# EAGLE design LoRaLo_V30a (EAGLE 7.5.0)
RFM95W
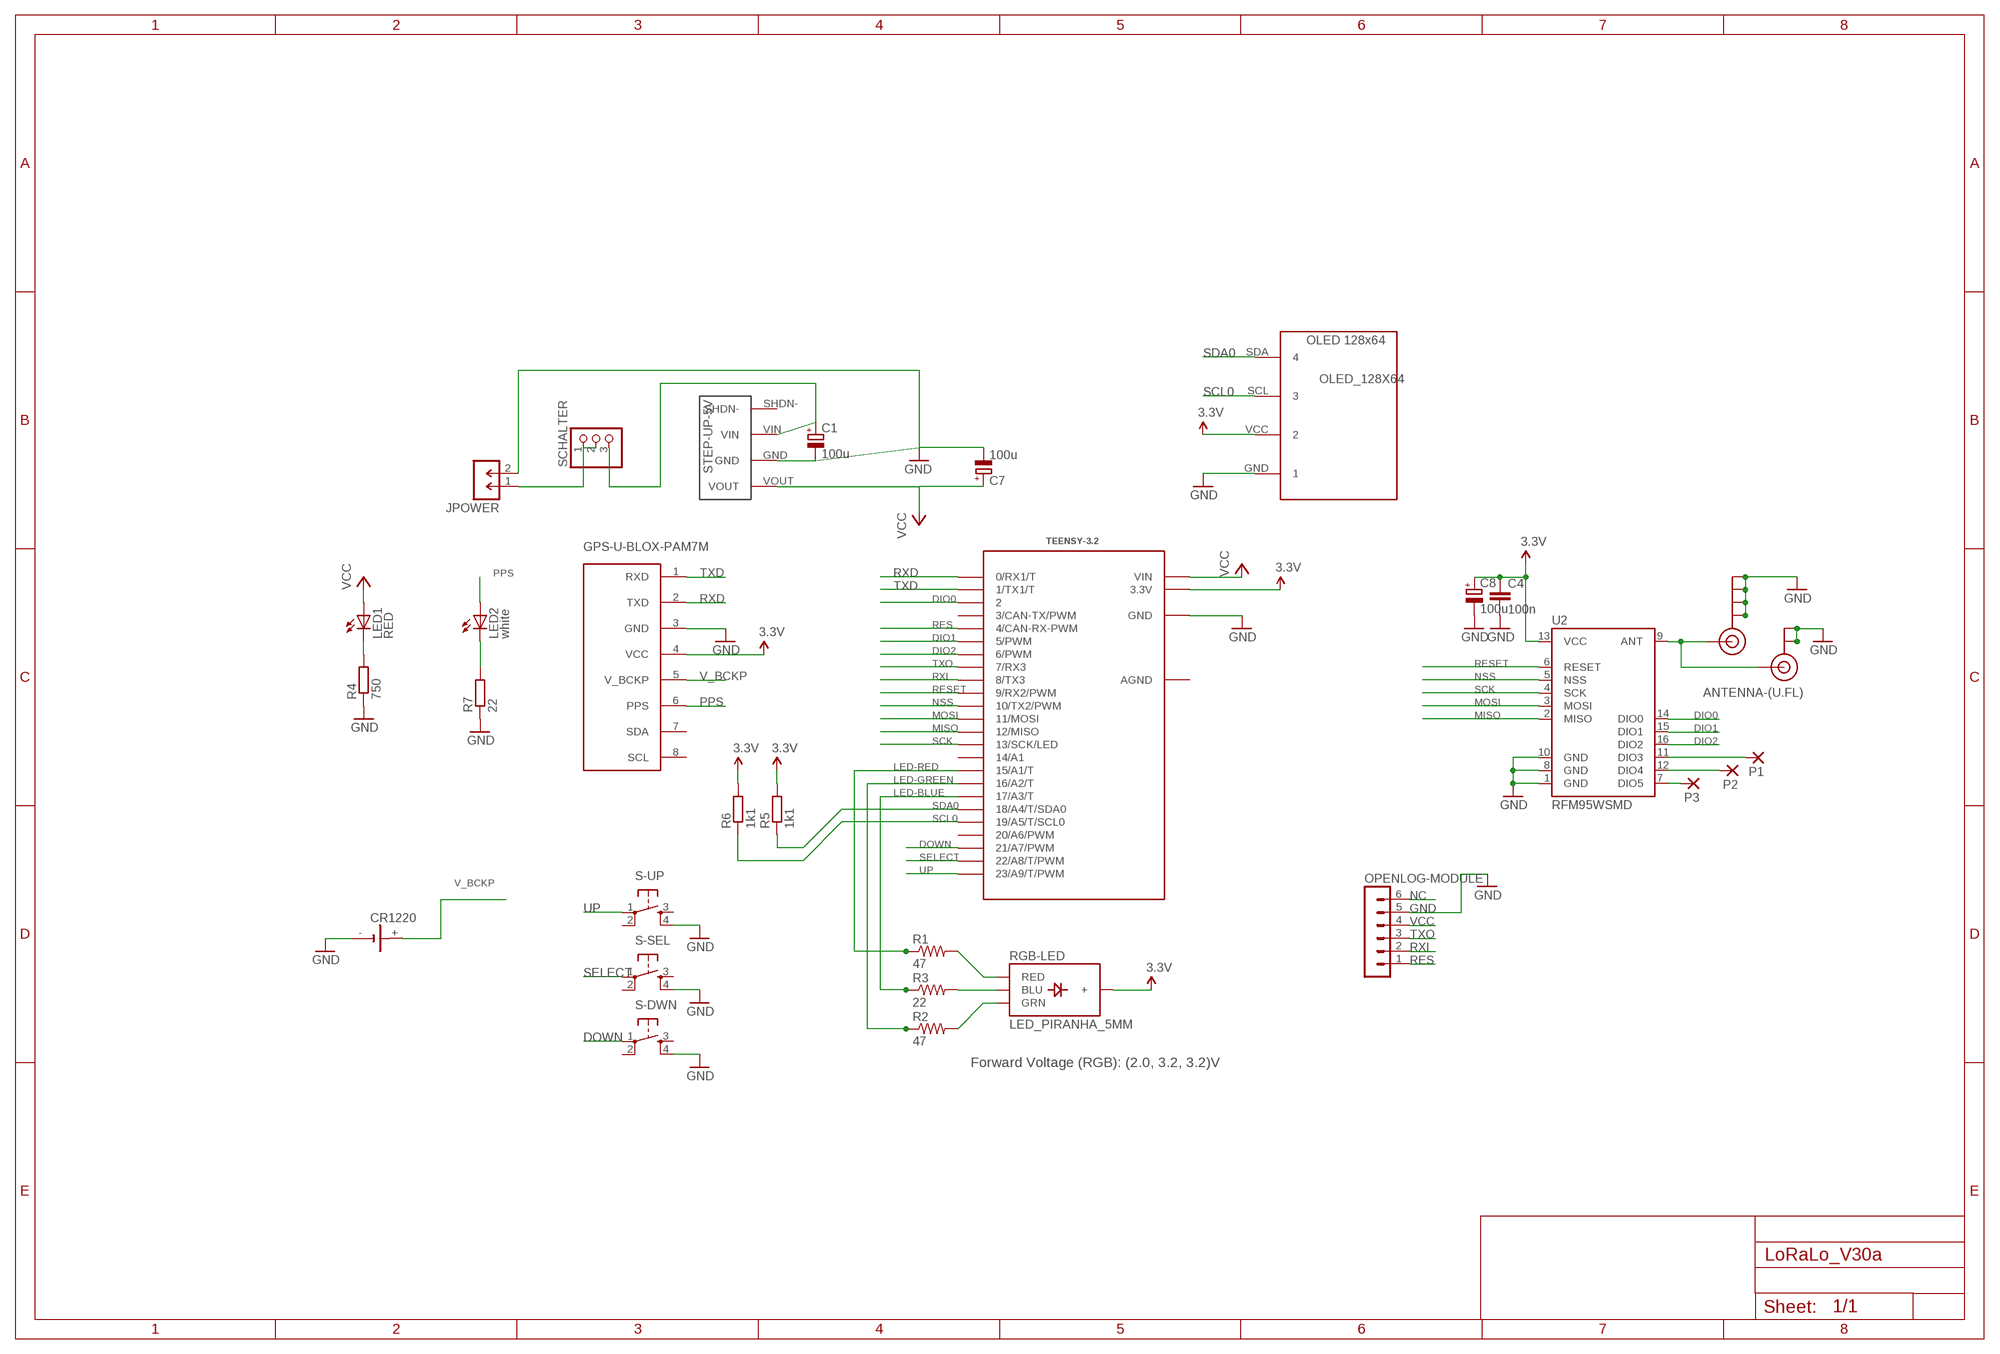
[diagram p0: schematic, sheet 1]

## Parts
ANTENNA-(EDGE-MOUNT)  SMA_EDGE  [SMA-EDGE]
ANTENNA-(U.FL)  U.FL  [U.FL]
C1  100u  CPOL-EUD  [PANASONIC_D]
C4  100n  C-EUC1206  [C1206]
C7  100u  CPOL-EUD  [PANASONIC_D]
C8  100u  CPOL-EUD  [PANASONIC_D]
CR1220  CH291-1220LF  [CH291-1220LF]
GPS-U-BLOX-PAM7M  U-BLOX-PAM-7Q  [U-BLOX-PAM-7Q]
JPOWER  M-1X02-SIP-100-40  [SIP-100-02-40]
LED1  RED  LED1206  [LED-1206]
LED2  white  LED1206  [LED-1206]
OLED_128X64  OLED_128X64  [OLED_128X64]
OPENLOG-MODULE  MA06-1  [MA06-1]
P1  1,6/0,8  [1,6/0,8]
P2  1,6/0,8  [1,6/0,8]
P3  1,6/0,8  [1,6/0,8]
R1  47  RESISTOR1206  [1206]
R2  47  RESISTOR1206  [1206]
R3  22  RESISTOR1206  [1206]
R4  750  R-EU_M1206  [M1206]
R5  1k1  R-EU_M1206  [M1206]
R6  1k1  R-EU_M1206  [M1206]
R7  22  R-EU_M1206  [M1206]
RGB-LED  LED_PIRANHA_5MM  [LED_PIRANHA_5MM]
S-DWN  TAC_SWITCHPTH  [TACTILE-PTH]
S-SEL  TAC_SWITCHPTH  [TACTILE-PTH]
S-UP  TAC_SWITCHPTH  [TACTILE-PTH]
SCHALTER  PINHD-1X3  [1X03]
STEP-UP-5V  POLOLU_STEP-UP  [POLOLU_STEP-UP]
TEENSY-3.2  TEENSY_3.1_DIL  [TEENSY3-DIL]
U2  RFM95WSMD  [RFM95W_SMD]

## Nets
3.3V [power]: C4.1 C8.+ GPS-U-BLOX-PAM7M.4(VCC) OLED_128X64.VCC R5.2 R6.2 RGB-LED.+ TEENSY-3.2.3.3V U2.13(VCC)
DIO0: TEENSY-3.2.2 U2.14(DIO0)
DIO1: TEENSY-3.2.5(5/PWM) U2.15(DIO1)
DIO2: TEENSY-3.2.6(6/PWM) U2.16(DIO2)
DOWN: S-DWN.1 TEENSY-3.2.21/A7(21/A7/PWM)
GND [power]: ANTENNA-(EDGE-MOUNT).GND@0(GND) ANTENNA-(EDGE-MOUNT).GND@1(GND) ANTENNA-(EDGE-MOUNT).GND@2(GND) ANTENNA-(EDGE-MOUNT).GND@3(GND) ANTENNA-(U.FL).P$1(GND) ANTENNA-(U.FL).P$2(GND) C1.- C4.2 C7.- C8.- CR1220.- GPS-U-BLOX-PAM7M.3(GND) JPOWER.2 OLED_128X64.GND OPENLOG-MODULE.5 R4.1 R7.1 S-DWN.4 S-SEL.4 S-UP.4 STEP-UP-5V.GND TEENSY-3.2.GND U2.1(GND) U2.8(GND) U2.10(GND)
LED-BLUE: R3.1 TEENSY-3.2.17/A3(17/A3/T)
LED-GREEN: R2.1 TEENSY-3.2.16/A2(16/A2/T)
LED-RED: R1.1 TEENSY-3.2.15/A1(15/A1/T)
MISO: TEENSY-3.2.12(12/MISO) U2.2(MISO)
MOSI: TEENSY-3.2.11(11/MOSI) U2.3(MOSI)
N$1: R1.2 RGB-LED.R(RED)
N$2: P1.1(P) U2.11(DIO3)
N$3: R2.2 RGB-LED.G(GRN)
N$4: C1.+ SCHALTER.3 STEP-UP-5V.VIN
N$5: ANTENNA-(EDGE-MOUNT).SIG(SIGNAL) ANTENNA-(U.FL).P$3(SIGNAL) U2.9(ANT)
N$6: P2.1(P) U2.12(DIO4)
N$7: P3.1(P) U2.7(DIO5)
N$9: R3.2 RGB-LED.B(BLU)
N$10: JPOWER.1 SCHALTER.1 SCHALTER.2
N$11: LED2.C R7.2
N$23: LED1.C R4.2
NC: OPENLOG-MODULE.6
NSS: TEENSY-3.2.10(10/TX2/PWM) U2.5(NSS)
PPS: GPS-U-BLOX-PAM7M.6(PPS) LED2.A
RES: OPENLOG-MODULE.1 TEENSY-3.2.4(4/CAN-RX-PWM)
RESET: TEENSY-3.2.9(9/RX2/PWM) U2.6(RESET)
RXD: GPS-U-BLOX-PAM7M.2(TXD) TEENSY-3.2.0(0/RX1/T)
RXI: OPENLOG-MODULE.2 TEENSY-3.2.8(8/TX3)
SCK: TEENSY-3.2.13(13/SCK/LED) U2.4(SCK)
SCL0: OLED_128X64.SCL R6.1 TEENSY-3.2.19/A5(19/A5/T/SCL0)
SDA0: OLED_128X64.SDA R5.1 TEENSY-3.2.18/A4(18/A4/T/SDA0)
SELECT: S-SEL.1 TEENSY-3.2.22/A8(22/A8/T/PWM)
TXD: GPS-U-BLOX-PAM7M.1(RXD) TEENSY-3.2.1(1/TX1/T)
TXO: OPENLOG-MODULE.3 TEENSY-3.2.7(7/RX3)
UP: S-UP.1 TEENSY-3.2.23/A9(23/A9/T/PWM)
V_BCKP: CR1220.+ GPS-U-BLOX-PAM7M.5(V_BCKP)
VCC [power]: C7.+ LED1.A OPENLOG-MODULE.4 STEP-UP-5V.VOUT TEENSY-3.2.VIN
Unconnected: GPS-U-BLOX-PAM7M.7(SDA) GPS-U-BLOX-PAM7M.8(SCL) S-DWN.2 S-DWN.3 S-SEL.2 S-SEL.3 S-UP.2 S-UP.3 STEP-UP-5V.SHDN- TEENSY-3.2.3(3/CAN-TX/PWM) TEENSY-3.2.14/A0(14/A1) TEENSY-3.2.20/A6(20/A6/PWM)

## Notes on the sheet
- Forward Voltage (RGB): (2.0, 3.2, 3.2)V

## Power pins joined to a net without a drawn wire
AGND: TEENSY-3.2.AGND

## Library data of the parts
ANTENNA-(EDGE-MOUNT) = SparkFun-Connectors:SMA_EDGE: SMA Antenna Connector End launch SMA connector. The paste layer has been removed so that the connector can be hand soldered onto the board after reflow.
ANTENNA-(U.FL) = SparkFun-Connectors:U.FL: SMD antenna connector- WRL-09144; PROD_ID: CONN-09193
C1 C7 C8 = rcl:CPOL-EU: POLARIZED CAPACITOR, European symbol
C4 = resistor:C-EU: CAPACITOR, European symbol
CR1220 = battery_mod:CH291-1220LF: Battery Holder, SMT, 12mm multicomp PART NO. CH291-1220LF Source: Data sheet <http://www.farnell.com/datasheets/1505860.pdf>
GPS-U-BLOX-PAM7M = u-blox:U-BLOX-PAM-7Q
JPOWER = con-headers-jp:M-1X02-: MALE HEADER
LED1 LED2 = SparkFun-LED:LED: LEDs Standard schematic elements and footprints for 5mm, 3mm, 1206, and 0603 sized LEDs. 5mm - Spark Fun Electronics SKU : COM-00529 (and others)
OLED_128X64 = OLED:OLED_128X64
OPENLOG-MODULE = con-lstb:MA06-1: PIN HEADER; OC_FARNELL: unknown; OC_NEWARK: unknown
P1-P3 = wirepad:1,6/0,8: THROUGH-HOLE PAD
R1-R3 = SparkFun-Passives:RESISTOR: Resistor Basic schematic elements and footprints for 0603, 1206, and PTH resistors.
R4-R7 = rcl:R-EU_: RESISTOR, European symbol
RGB-LED = SparkFun-LED_mod:LED_PIRANHA_5MM: High-brightness RGB through-hole LED, similar to that used in the Shiftbrite
S-DWN S-SEL S-UP = SparkFun-Retired:TAC_SWITCH: Momentary Switch Button commonly used for reset or general input. Spark Fun Electronics SKU : COM-00097 SMT- SWCH-08247
SCHALTER = pinhead:PINHD-1X3: PIN HEADER
STEP-UP-5V = Pololu_Step-Up:POLOLU_STEP-UP
TEENSY-3.2 = Teensy_3_and_LC_Series_Boards_v1.1:TEENSY_3.1_DIL: Teensy 3.1 or 3.2 in a DIL Layout.
U2 = misiek:RFM95W

## Net classes
0 default: width 0.12 mm
1 power: width 0.762 mm, drill 0.457 mm, clearance 0.457 mm

## Board
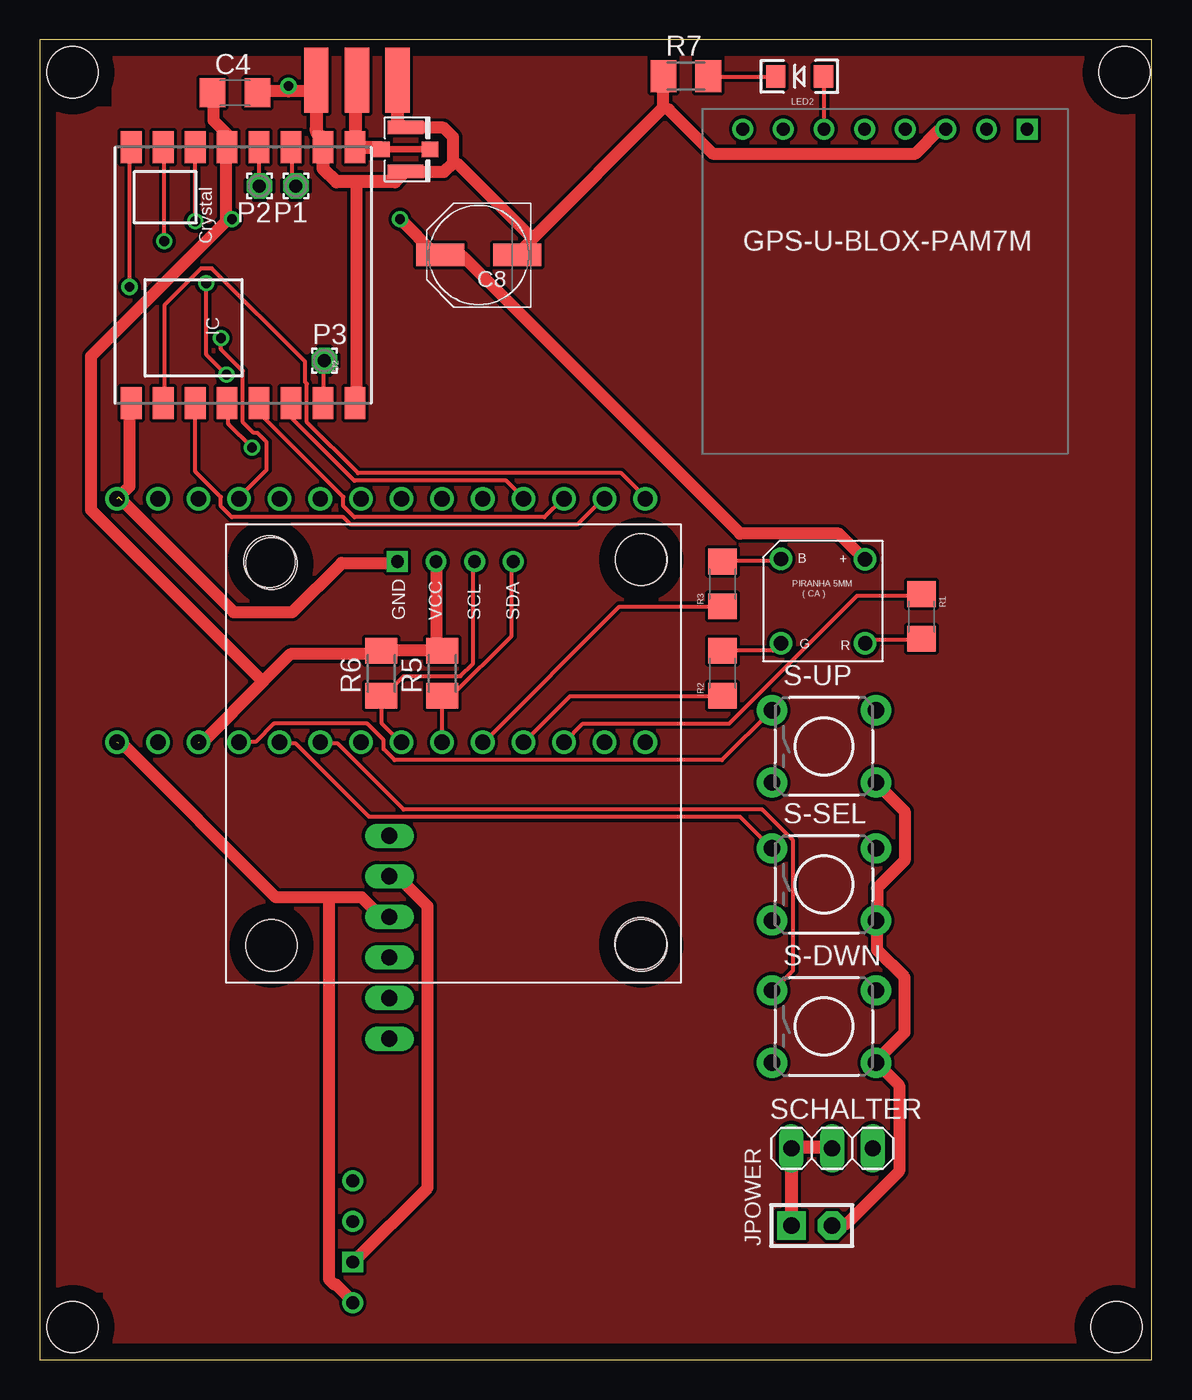
[diagram p1: board, top side]
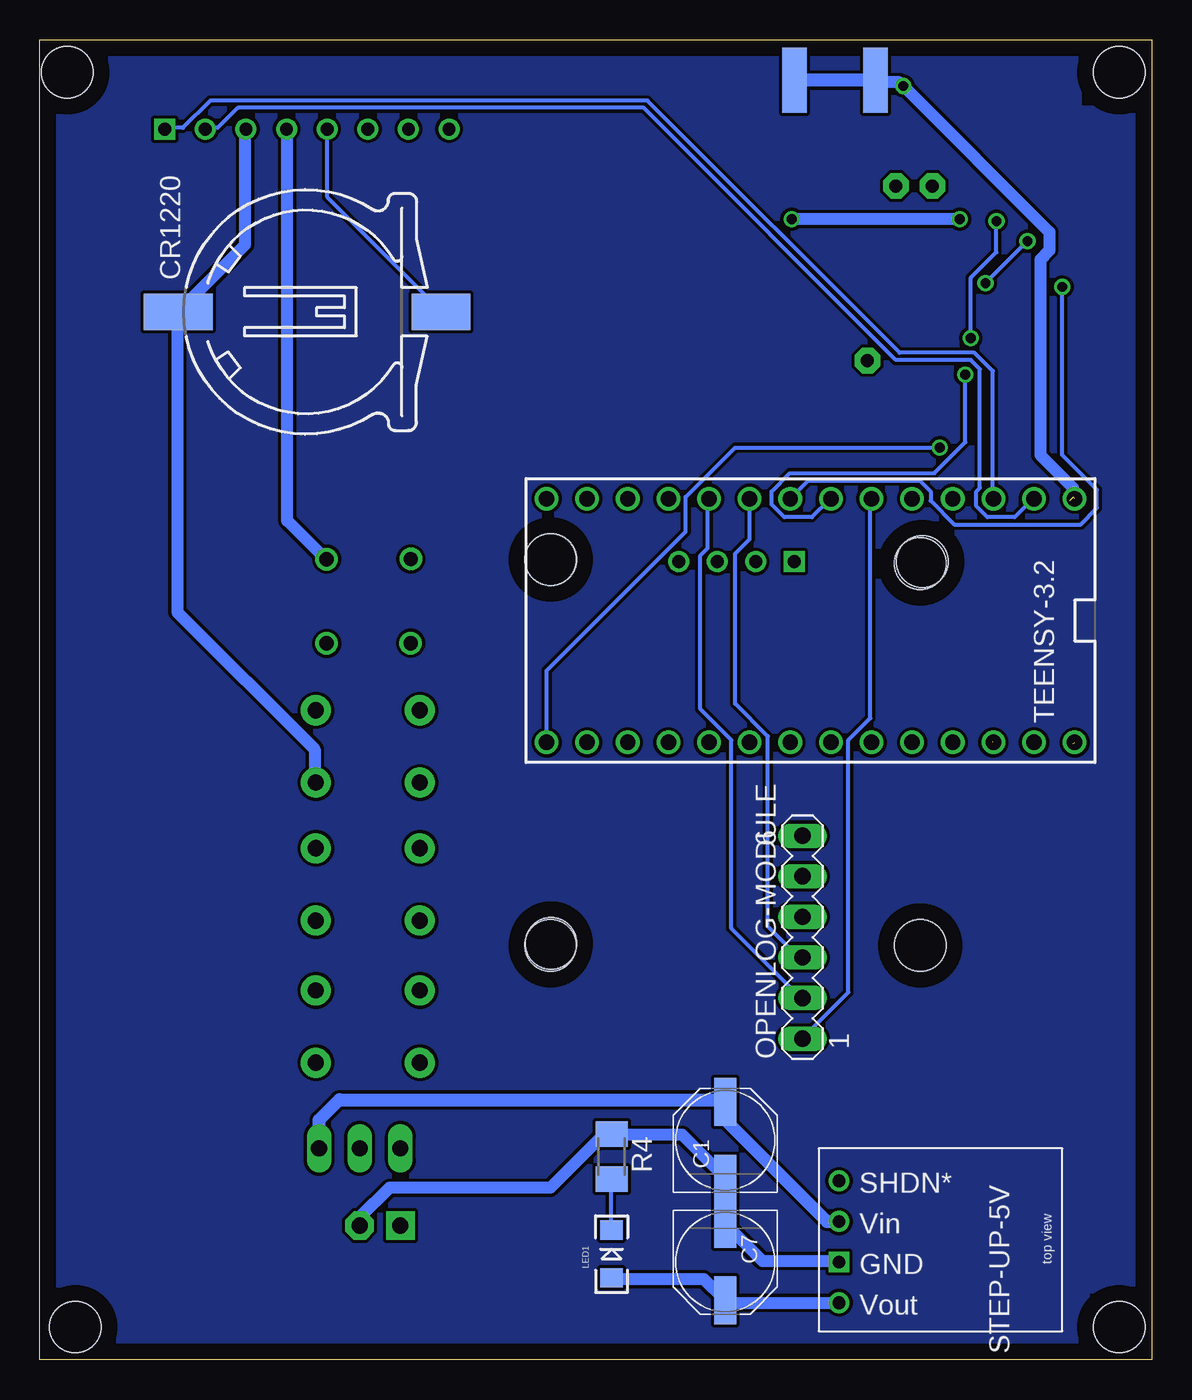
[diagram p2: board, bottom side, seen from below]

Size 69.52 x 82.54 mm. Coordinates in mm from the lower left corner, seen from the top.
Outline: 0,0 69.52,0 69.52,82.54 0,82.54 0,0
Copper layers (1*16): Top 0.035mm / dielectric 1.5mm / Bottom 0.035mm
Design rules "default": minimum track width 10mil, minimum drill 24mil, track to track 8mil, track to pad 8mil, pad to pad 8mil, via to via 8mil, smd to smd 8mil, copper to edge 40mil, drill to drill 8mil, minimum pad ring 10mil, minimum via ring 8mil, stop-mask expansion 4mil, vias tented up to drill 0mil, thermal gap 10mil
Holes 3.2 mm at 2.03,80.52 67.82,80.52 14.48,25.91 67.31,2.03 37.59,25.91 2.03,2.03 14.48,49.78 37.59,50.04

### Footprints (pad centres in the part's own frame; a part is rotated, then mirrored left to right if it is on the bottom)
SMA-EDGE = smd 1.524 x 4.064: GND@0 0,0; GND@1 5.08,0; SIG 2.54,0 | smd 1.524 x 4.064 bottom: GND@2 0,0; GND@3 5.08,0
U.FL = smd 2.2 x 0.85: P$1 0,1.375; P$2 0,-1.375 | smd 1.05 x 1: P$3 1.525,0; P$4 -1.525,0
PANASONIC_D = smd 3 x 1.4: + 2.4,0; - -2.4,0
C1206 = smd 1.6 x 1.8: 1 -1.4,0; 2 1.4,0
CH291-1220LF = smd 2.3 x 3.66: + 0,-2.296 | smd 2.3 x 4.3: - 0,14.146
U-BLOX-PAM-7Q = drill 0.8 square: 1 3.81,-2.54 | drill 0.8: 2 1.27,-2.54; 3 -1.27,-2.54; 4 -3.81,-2.54; 5 -6.35,-2.54; 6 -8.89,-2.54; 7 -11.43,-2.54; 8 -13.97,-2.54
SIP-100-02-40 = drill 1.016 pad 1.778 square: 1 -1.27,0 | drill 1.016 pad 1.778 octagon: 2 1.27,0
LED-1206 = smd 1.2 x 1.4: A -1.5,0; C 1.5,0
OLED_128X64 = drill 0.8 square: GND -1.778,10.541 | drill 0.8: SCL 3.044,10.54; SDA 5.455,10.541; VCC 0.633,10.541 | hole 3.2: -9.776,10.539; 13.444,10.666; 13.441,-13.345; -9.65,-13.473
MA06-1 = drill 1.016 long: 1 -6.35,0; 2 -3.81,0; 3 -1.27,0; 4 1.27,0; 5 3.81,0; 6 6.35,0
1,6/0,8 = drill 0.813 pad 1.6 octagon: 1 0,0
1206 = smd 1.6 x 1.8: 1 -1.4,0; 2 1.4,0
M1206 = smd 1.6 x 2: 1 -1.4,0; 2 1.4,0
LED_PIRANHA_5MM = drill 0.9: + 2.575,2.562; B -2.688,2.574; G -2.684,-2.684; R 2.579,-2.696
TACTILE-PTH = drill 1.016 pad 1.88: 1 -3.251,2.261; 2 3.251,2.261; 3 -3.251,-2.261; 4 3.251,-2.261
1X03 = drill 1.016 long: 1 -2.54,0; 2 0,0; 3 2.54,0
POLOLU_STEP-UP = drill 0.8 square: GND 7.112,1.27 | drill 0.8: SHDN- 2.032,1.27; VIN 4.572,1.27; VOUT 9.652,1.27
TEENSY3-DIL = drill 0.965: 0 -7.62,13.97; 1 -7.62,11.43; 2 -7.62,8.89; 3 -7.62,6.35; 3.3V 7.62,11.43; 4 -7.62,3.81; 5 -7.62,1.27; 6 -7.62,-1.27; 7 -7.62,-3.81; 8 -7.62,-6.35; 9 -7.62,-8.89; 10 -7.62,-11.43; 11 -7.62,-13.97; 12 -7.62,-16.51; 13 7.62,-16.51; 14/A0 7.62,-13.97; 15/A1 7.62,-11.43; 16/A2 7.62,-8.89; 17/A3 7.62,-6.35; 18/A4 7.62,-3.81; 19/A5 7.62,-1.27; 20/A6 7.62,1.27; 21/A7 7.62,3.81; 22/A8 7.62,6.35; 23/A9 7.62,8.89; AGND 7.62,13.97; GND -7.62,16.51; VIN 7.62,16.51
RFM95W_SMD = smd 2 x 1.3: 1 -8,7; 2 -8,5; 3 -8,3; 4 -8,1; 5 -8,-1; 6 -8,-3; 7 -8,-5; 8 -8,-7; 9 8,-7; 10 8,-5; 11 8,-3; 12 8,-1; 13 8,1; 14 8,3; 15 8,5; 16 8,7

### Placement (x,y rotation side)
ANTENNA-(EDGE-MOUNT)  17.27,80.01 0 top
ANTENNA-(U.FL)  22.86,75.69 0 top
C1  26.67,13.72 90 bottom
C4  12.19,79.25 0 top
C7  26.67,6.1 270 bottom
C8  27.43,69.09 180 top
CR1220  46.74,65.53 90 bottom
GPS-U-BLOX-PAM7M  57.91,79.5 0 top
JPOWER  48.26,8.38 0 top
LED1  33.78,6.6 90 bottom
LED2  47.5,80.26 180 top
OLED_128X64  24.13,39.37 0 top
OPENLOG-MODULE  21.84,26.42 90 bottom
P1  16,73.41 180 top
P2  13.72,73.41 180 top
P3  17.78,62.48 0 top
R1  55.12,46.48 270 top
R2  42.67,42.93 90 top
R3  42.67,48.51 90 top
R4  33.78,12.7 270 bottom
R5  25.15,42.93 90 top
R6  21.34,42.93 90 top
R7  40.39,80.26 0 top
RGB-LED  49.02,47.5 0 top
S-DWN  49.02,20.83 0 top
S-SEL  49.02,29.72 0 top
S-UP  49.02,38.35 0 top
SCHALTER  49.53,13.21 0 top
STEP-UP-5V  20.83,13.21 270 bottom
TEENSY-3.2  21.34,46.23 270 bottom
U2  12.7,67.82 90 top

### Tracks (layer width: path | path; a pad name or v marks a point on that pad's centre or on a via)
3.3V  (via drill 0.61)  (1 unrouted)
  Top 0.762: RGB-LED.+ 51.55,50.06 49.95,51.66 43.78,51.66 26.4,69.04 25.15,69.04 C8.+ 24.69,69.15 v22.52,71.32 | C4.1 10.86,79.21 10.86,77.5 11.66,76.69 11.66,75.89 U2.13 11.66,75.44 11.66,71.32 | OLED_128X64.VCC 24.8,49.84 24.8,44.69 R5.2 25.15,44.35 21.37,44.35 R6.2 21.03,44.12 15.66,44.12 13.95,42.41 | 9.94,38.63 10.17,38.63 13.95,42.41 | 11.66,71.32 11.66,71.21 3.2,62.75 3.2,53.15 13.95,42.41 | v12,71.32 11.66,71.32
  Bottom 0.762: GPS-U-BLOX-PAM7M.4 54.06,76.92 54.06,52.46 51.66,50.06 RGB-LED.+ | v12,71.32 v22.52,71.32
DIO0  (via drill 0.61)
  Top 0.254: v9.72,71.21 9.72,75.78 U2.14 | v11.32,63.89 11.32,63.21 12.69,61.84 12.69,58.64 13.37,57.95 13.6,57.95 14.17,57.38 14.17,55.66 12.46,53.95 TEENSY-3.2.2
  Bottom 0.254: v9.72,71.21 9.72,69.27 11.32,67.67 v11.32,63.89
DIO1  (via drill 0.61)
  Top 0.254: v7.77,69.95 7.77,75.78 U2.15 | v10.4,67.32 10.4,62.87 v11.66,61.61
  Bottom 0.254: v10.4,67.32 v7.77,69.95 | v11.66,61.61 11.66,57.38 13.6,55.44 22.63,55.44 23.77,54.29 23.77,53.49 22.97,52.69 21.26,52.69 20.12,53.84 TEENSY-3.2.5
DIO2  (via drill 0.61)
  Top 0.254: v5.6,67.09 5.6,75.78 U2.16
  Bottom 0.254: v5.6,67.09 5.6,56.58 3.43,54.41 3.43,53.26 4.46,52.23 12.34,52.23 13.83,53.72 13.83,54.29 14.52,54.98 21.49,54.98 22.52,53.95 TEENSY-3.2.6
DOWN
  Top 0.254: TEENSY-3.2.21/A7 17.6,38.52 18.63,38.52 22.75,34.4 45.15,34.4 47.09,32.46 47.09,24.35 45.83,23.09 S-DWN.1
GND  (via drill 0.61)  (3 unrouted)
  Top 0.762: S-UP.4 52.35,36.01 54.06,34.29 54.06,31.2 52.35,29.49 52.35,27.55 S-SEL.4 52.35,27.09 52.35,25.6 54.06,23.89 54.06,20.46 52.46,18.86 S-DWN.4 52.35,18.52 53.72,17.14 53.72,11.77 50.41,8.46 49.61,8.46 JPOWER.2 | OPENLOG-MODULE.5 21.95,30.18 22.4,30.18 24.23,28.35 24.23,10.74 19.66,6.17 STEP-UP-5V.GND | 4.92,53.95 5.6,54.63 5.6,59.78 U2.1 | 5.14,53.72 12.12,46.75 15.77,46.75 18.86,49.84 22.29,49.84 OLED_128X64.GND | 15.54,79.32 16.92,79.32 ANTENNA-(EDGE-MOUNT).GND@0 | 15.54,79.32 13.6,79.32 C4.2 | 19.77,73.66 19.77,59.89 U2.8 | 25.83,74.87 25.83,76.47 25.26,77.04 23.2,77.04 ANTENNA-(U.FL).P$1 | 25.83,74.87 25.26,74.3 23.2,74.3 ANTENNA-(U.FL).P$2 | v15.54,79.67 15.54,79.32 | 38.98,78.3 38.98,80.24 R7.1 | 30.8,70.12 29.83,69.15 C8.- | 30.8,70.12 38.98,78.3 | GPS-U-BLOX-PAM7M.3 56.58,76.92 56.24,76.92 54.75,75.44 42.06,75.44 39.32,78.18 38.98,78.3 | 30.8,70.12 26.18,74.75 25.83,74.87
  Top 0.813: ANTENNA-(EDGE-MOUNT).GND@0 17.27,76.96 arc90 17.78,76.45 17.78,75.9 arc-90 U2.10 17.7,74.5 18.54,73.66 19.77,73.66 22.2,73.66 ANTENNA-(U.FL).P$2 | ANTENNA-(EDGE-MOUNT).GND@1 22.35,77.58 arc90 ANTENNA-(U.FL).P$1
  Bottom 0.762: STEP-UP-5V.GND 19.66,6.17 24.35,6.17 26.63,8.46 C7.- 26.75,8.8 26.75,10.97 C1.- 26.75,11.43 29.38,14.06 33.72,14.06 R4.1 34.18,14.17 37.6,10.74 47.66,10.74 49.49,8.91 49.49,8.46 JPOWER.2 | ANTENNA-(EDGE-MOUNT).GND@0 16.92,79.9 15.77,79.9 v15.54,79.67 6.4,70.52 6.4,69.38 6.97,68.81 6.97,56.58 4.92,54.52 4.92,53.95 | GPS-U-BLOX-PAM7M.3 56.69,76.92 56.69,69.72 60.81,65.61 CR1220.- 60.92,65.15 60.92,46.75 52.35,38.18 52.35,36.12 S-UP.4
  Bottom 0.813: ANTENNA-(EDGE-MOUNT).GND@0 ANTENNA-(EDGE-MOUNT).GND@1
LED-BLUE
  Top 0.254: R3.1 42.63,47.09 36.23,47.09 27.77,38.63 TEENSY-3.2.17/A3
LED-GREEN
  Top 0.254: R2.1 42.63,41.49 33.15,41.49 30.29,38.63 TEENSY-3.2.16/A2
LED-RED
  Top 0.254: R1.1 55.09,47.78 51.09,47.78 43.09,39.78 33.95,39.78 32.8,38.63 TEENSY-3.2.15/A1
MISO
  Top 0.254: U2.2 7.77,59.89 7.77,65.95 10.06,68.24 10.74,68.24 16.57,62.41 16.57,61.15 16.69,61.04 16.69,58.64 19.89,55.44 36.35,55.44 37.83,53.95 TEENSY-3.2.12
MOSI
  Top 0.254: U2.3 9.72,59.78 9.72,55.55 11.32,53.95 11.32,53.38 12,52.69 18.97,52.69 19.43,52.23 33.6,52.23 35.2,53.84 TEENSY-3.2.11
N$1
  Top 0.254: R1.2 55.09,45.03 51.89,45.03 51.66,44.81 RGB-LED.R
N$2
  Top 0.254: U2.11 15.77,75.78 15.77,73.72 16,73.5 P1.1
N$3
  Top 0.254: R2.2 42.75,44.35 45.83,44.35 46.29,44.81 RGB-LED.G
N$4
  Bottom 0.813: SCHALTER.3 52.07,14.99 50.8,16.26 26.81,16.26 C1.+ 26.67,14.99 20.32,8.64 STEP-UP-5V.VIN
N$5
  Top 0.406: 21.34,75.69 ANTENNA-(U.FL).P$3
  Top 0.813: 21.34,75.69 21.34,75.82 U2.9 19.7,80.01 ANTENNA-(EDGE-MOUNT).SIG
N$6
  Top 0.254: P2.1 13.72,75.78 U2.12
N$7
  Top 0.254: U2.7 17.72,59.89 17.72,62.41 P3.1
N$8
  pour Top: 4.57,82.04 4.57,78.23 0.51,78.23 0.51,4.32 4.06,4.32 4.06,0.51 65.28,0.51 65.28,4.06 68.83,4.06 68.83,78.49 65.79,78.49 65.79,82.04
N$9
  Top 0.254: R3.2 42.75,49.95 46.18,49.95 46.29,50.06 RGB-LED.B
N$10
  Top 0.254: 47.09,13.26 SCHALTER.1 46.98,13.14 | 49.49,13.26 SCHALTER.2
  Top 0.813: 49.49,13.26 46.99,13.26 SCHALTER.1 | 46.98,13.14 46.99,13.14 JPOWER.1
N$11
  Top 0.254: LED2.C 45.95,80.24 41.83,80.24 R7.2
N$12
  pour Top: 4.57,82.04 4.57,78.23 0.51,78.23 0.51,4.32 4.06,4.32 4.06,0.51 65.28,0.51 65.28,4.06 68.83,4.06 68.83,78.49 65.79,78.49 65.79,82.04
N$13
  pour Bottom: 0.51,78.23 0.51,4.32 4.06,4.32 4.06,4.06 4.06,0.51 65.28,0.51 65.28,4.06 68.83,4.06 68.83,78.49 65.79,78.49 65.79,82.04 4.57,82.04 4.57,78.23
N$23
  Bottom 0.254: LED1.C 33.83,8.12 33.83,11.2 R4.2
NSS
  Top 0.254: U2.5 13.72,59.78 13.72,59.21 18.97,53.95 18.97,53.38 19.66,52.69 31.55,52.69 32.69,53.84 TEENSY-3.2.10
PPS
  Top 0.254: LED2.A 49.03,80.24 49.03,77.04 GPS-U-BLOX-PAM7M.6
RES
  Bottom 0.254: TEENSY-3.2.4 17.6,53.84 17.6,40.12 18.97,38.75 18.97,22.97 21.83,20.12 OPENLOG-MODULE.1
RESET
  Top 0.254: U2.6 15.77,59.78 15.77,58.86 19.66,54.98 29.15,54.98 30.18,53.95 TEENSY-3.2.9
RXD
  Bottom 0.254: GPS-U-BLOX-PAM7M.2 59.09,77.04 58.41,77.04 57.15,78.3 31.77,78.3 16,62.52 11.32,62.52 10.74,61.95 10.74,54.52 10.97,54.29 10.97,53.38 10.29,52.69 8.57,52.69 7.43,53.84 TEENSY-3.2.0
RXI
  Bottom 0.254: TEENSY-3.2.8 27.77,53.84 27.77,50.75 28.23,50.29 28.23,40.69 26.29,38.75 26.29,26.98 21.95,22.63 OPENLOG-MODULE.2
SCK  (via drill 0.61)
  Top 0.254: v13.26,57.04 11.77,58.52 11.77,59.78 U2.4
  Bottom 0.254: v13.26,57.04 26.06,57.04 29.15,53.95 29.15,51.78 37.83,43.09 37.83,38.63 TEENSY-3.2.13
SCL0
  Top 0.254: TEENSY-3.2.19/A5 22.52,38.63 21.37,39.78 21.37,41.49 R6.1 21.49,41.49 22.75,42.75 26.29,42.75 27.09,43.55 27.09,49.84 OLED_128X64.SCL
SDA0
  Top 0.254: TEENSY-3.2.18/A4 R5.1 25.26,41.49 25.72,41.49 29.49,45.26 29.49,49.84 OLED_128X64.SDA
SELECT
  Top 0.254: TEENSY-3.2.22/A8 15.09,38.52 16,38.52 20.57,33.95 43.78,33.95 45.72,32 S-SEL.1
TXD
  Bottom 0.254: GPS-U-BLOX-PAM7M.1 61.72,77.04 60.58,77.04 58.86,78.75 31.55,78.75 15.77,62.98 11.09,62.98 9.94,61.84 9.94,53.95 TEENSY-3.2.1
TXO
  Bottom 0.254: TEENSY-3.2.7 25.15,51.32 26.06,50.41 26.06,41.03 24,38.98 24,27.09 22.06,25.15 OPENLOG-MODULE.3
UP
  Top 0.254: TEENSY-3.2.23/A9 12.46,38.63 13.49,38.63 14.63,39.78 20.46,39.78 21.49,38.75 21.49,38.18 22.17,37.49 42.63,37.49 45.72,40.58 S-UP.1
V_BCKP
  Bottom 0.254: GPS-U-BLOX-PAM7M.5 51.55,76.92 51.55,72.69 44.46,65.61 CR1220.+
VCC  (1 unrouted)
  Top 0.762: 4.92,38.52 5.14,38.52 14.74,28.92 18.06,28.92 | 18.06,28.92 20.12,28.92 21.26,27.77 21.83,27.77 OPENLOG-MODULE.4 | 18.06,28.92 18.06,5.03 18.4,4.69 18.52,4.69 19.55,3.66 STEP-UP-5V.VOUT
  Bottom 0.762: LED1.A 33.72,5.03 28,5.03 26.75,3.77 C7.+ 26.29,3.54 19.66,3.54 STEP-UP-5V.VOUT

### Text on the board
Measures: PPS | Vin | GND
Document: LoRaWan Gateway Locator by ursm